# EAGLE design HGS_Reflector (EAGLE 9.4.0)
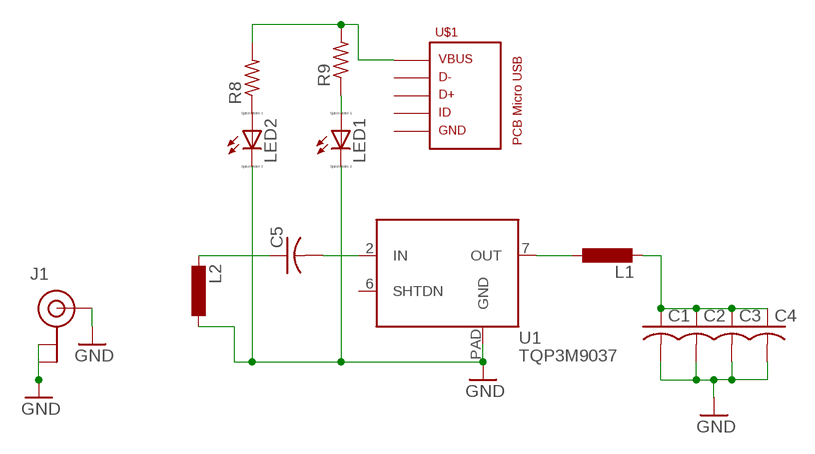
[diagram p0: schematic, sheet 1]

## Parts
C1  C-USC1210  [C1210]
C2  C-USC1210  [C1210]
C3  C-USC1210  [C1210]
C4  C-USC1210  [C1210]
C5  C-USC1210  [C1210]
J1  U.FL  [U.FL]
L1  L-EUL3216C  [L3216C]
L2  L-EUL3216C  [L3216C]
LED1  LED_E  [LED_1206]
LED2  LED_E  [LED_1206]
R8  R-US_R0402  [R0402]
R9  R-US_R0402  [R0402]
U1  TQP3M9037  [DFN8-2X2-WITH-PAD]
U$1  PCB_MICRO_USB_BSS_1  [USB_TYPE_B_SS_1]

## Nets
GND: C1.2 C2.2 C3.2 C4.2 J1.1(GND) J1.2(GND) J1.FEED(SIGNAL) L2.1 LED1.C LED2.C U1.PAD(GND)
N$5: L1.1 U1.7(OUT)
N$6: C1.1 C2.1 C3.1 C4.1 L1.2
N$7: C5.1 L2.2
N$8: C5.2 U1.2(IN)
N$9: LED2.A R8.1
N$10: LED1.A R9.1
N$11: R8.2 R9.2 U$1.1
Unconnected: U1.6(SHTDN) U$1.2 U$1.3 U$1.4 U$1.5

## Library data of the parts
C1-C5 = rcl:C-US: CAPACITOR, American symbol; SPICEPREFIX: C
J1 = SparkFun-Connectors:U.FL: SMD Antenna Connector - U.FL 2mm height, 3.0mm x 3.0mm receptacle size. SparkFun Products: SparkFun WiFi Shield - ESP8266 <https://www.sparkfun.com/products/13287> SparkFun ESP8266 Thing <https://www.sparkfun.com/products/13231> SparkFun MiniGen - Pro Mini Signal Generator Shield <https://www.sparkfun.com/products/11420>; PROD_ID: CONN-09193; SF_ID: WRL-09144
L1 L2 = rcl:L-EU: INDUCTOR, European symbol; SPICEPREFIX: L
LED1 LED2 = eagle-ltspice:LED_E: LED Source: http://www.osram.convergy.de Source: www.luxeon.com Source: www.kingbright.com; SPICEMODEL: NONE; SPICEPREFIX: D; SPICETYPE: diode
R8 R9 = rcl:R-US_: RESISTOR, American symbol; SPICEPREFIX: R
U1 = U-Qorvo-TQP3M9037-LNA:TQP3M9037: Ultra Low Noise, High Linearity LNA 0.7 - 6.0 GHz Operational Bandwidth Source: Datasheet <https://www.qorvo.com/products/p/TQP3M9037>
U$1 = USB_pcb_connectors:PCB_MICRO_USB_B

## Board
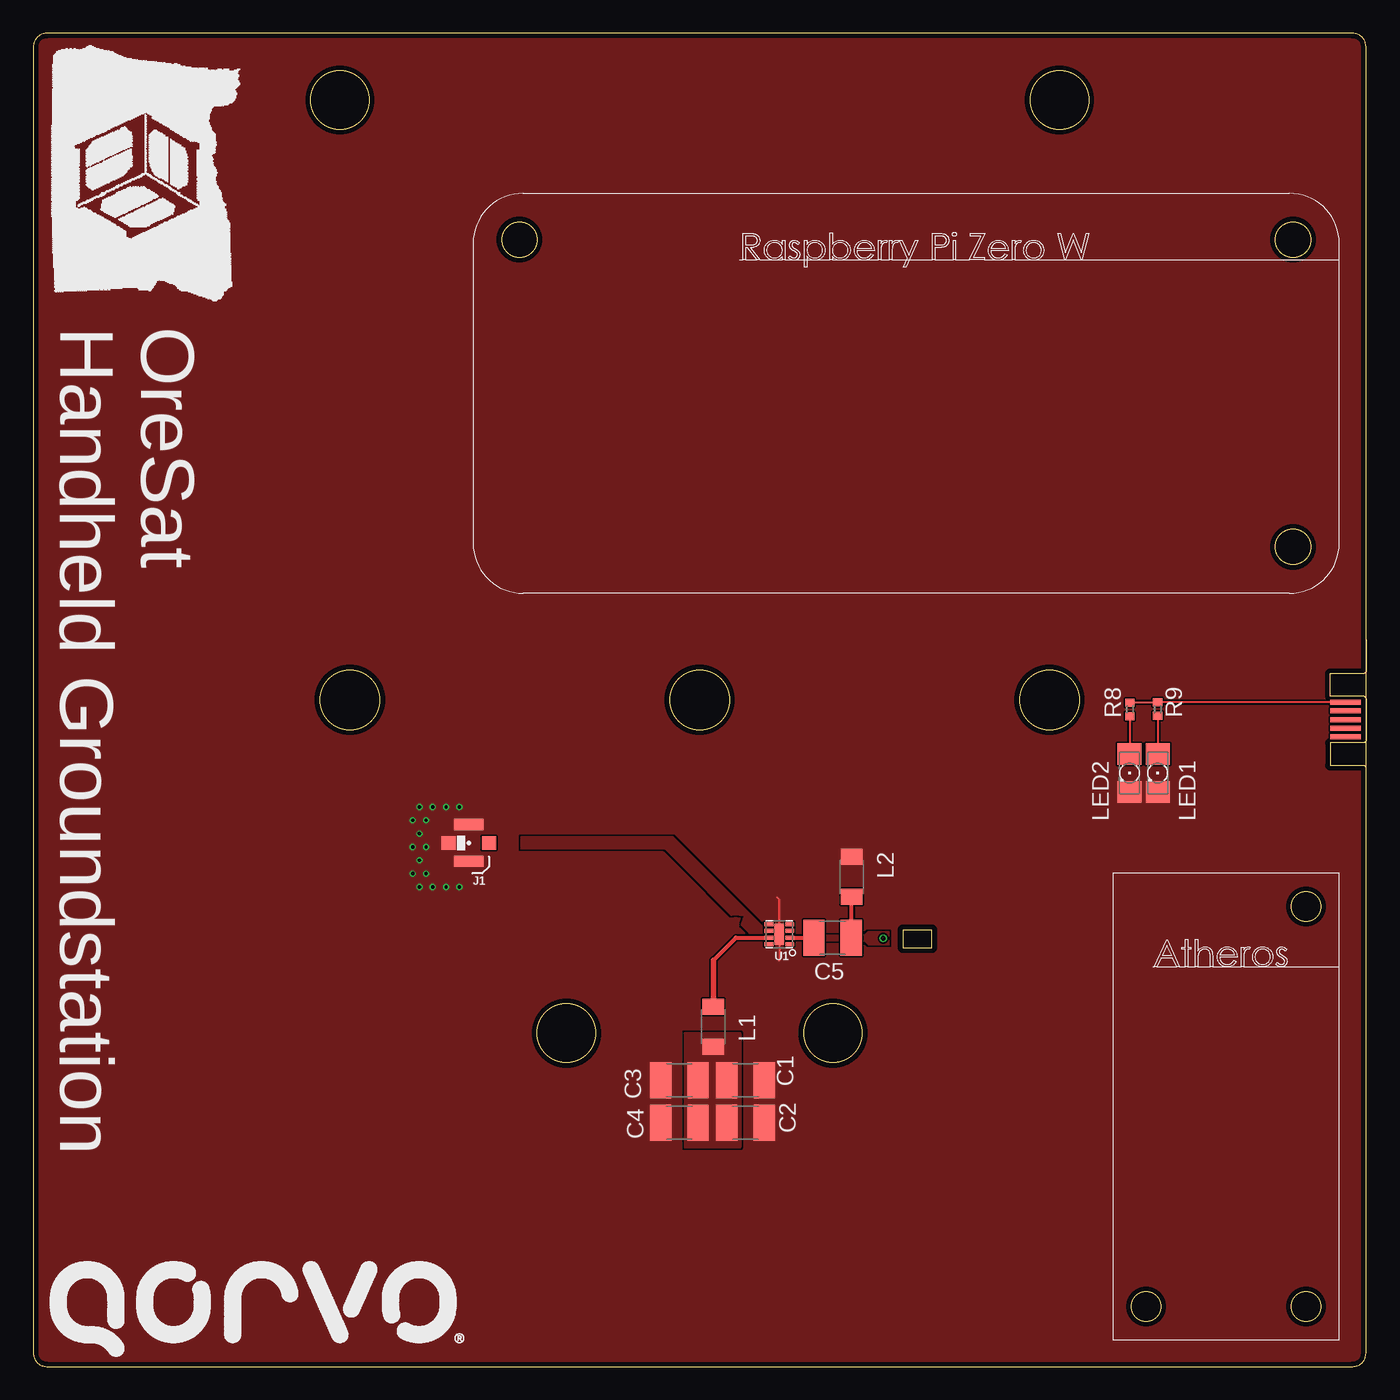
[diagram p1: board, top side]

Size 100.01 x 100 mm. Coordinates in mm from the lower left corner, seen from the top.
Outline: 100,1 100,99 arc90 99,100 1,100 arc90 0,99 0,1 arc90 1,0 99,0 arc90 100,1
Outline: 65.24,32.78 65.24,31.41 67.42,31.41 67.42,32.78 65.24,32.78
Outline: circle at 50,50 radius 2.25
Outline: circle at 40,25 radius 2.2
Outline: circle at 60,25 radius 2.2
Outline: circle at 94.53,61.48 radius 1.32
Outline: circle at 83.5,4.5 radius 1.1
Outline: circle at 76.25,50 radius 2.25
Outline: circle at 23.75,50 radius 2.25
Outline: circle at 94.53,84.53 radius 1.32
Outline: circle at 77,95 radius 2.2
Outline: circle at 23,95 radius 2.2
Outline: circle at 36.48,84.53 radius 1.32
Outline: circle at 95.5,34.5 radius 1.1
Outline: circle at 95.5,4.5 radius 1.1
Copper layers (1*2*15*16): Top 0.035559375mm / dielectric 0.17018125mm / Route2 0.01778125mm / dielectric 47mil / Route15 0.01778125mm / dielectric 0.17018125mm / Bottom 0.035559375mm
Design rules "oshpark-4layer-tented": minimum track width 5mil, minimum drill 10mil, track to track 5mil, track to pad 5mil, pad to pad 5mil, via to via 5mil, smd to smd 5mil, copper to edge 15mil, drill to drill 6mil, minimum pad ring 4mil, minimum via ring 4mil, stop-mask expansion 2.5mil, vias tented up to drill 20mil, thermal gap 10mil

### Footprints (pad centres in the part's own frame; a part is rotated, then mirrored left to right if it is on the bottom)
C1210 = smd 1.6 x 2.7: 1 -1.4,0; 2 1.4,0
U.FL = smd 2.2 x 0.85: 1 0,1.375; 2 0,-1.375 | smd 1.05 x 1: FEED 1.525,0; NC -1.525,0
L3216C = smd 1.2 x 1.6: 1 -1.5,0; 2 1.5,0
LED_1206 = smd 1.6 x 1.803: A -1.422,0; C 1.422,0
R0402 = smd 0.6 x 0.7: 1 -0.5,0; 2 0.5,0
DFN8-2X2-WITH-PAD = smd 0.3 x 0.67: 1 -0.75,-0.785; 2 -0.25,-0.785; 3 0.25,-0.785; 4 0.75,-0.785; 5 0.75,0.785; 6 0.25,0.785; 7 -0.25,0.785; 8 -0.75,0.785 | smd 1.6 x 0.7: PAD 0,0
USB_TYPE_B_SS_1 = smd 0.37 x 2.3: 1 -1.3,-1.55; 2 -0.65,-1.55; 3 0,-1.55; 4 0.65,-1.55; 5 1.3,-1.55

### Placement (x,y rotation side)
C1  53.44,21.47 0 top
C2  53.44,18.29 0 top
C3  48.47,21.47 180 top
C4  48.47,18.29 180 top
C5  59.97,32.16 180 top
J1  32.67,39.27 180 top
L1  51.02,25.5 270 top
L2  61.41,36.72 270 top
LED1  84.37,44.51 270 top
LED2  82.26,44.51 270 top
R8  82.28,49.29 90 top
R9  84.37,49.31 90 top
U1  55.97,32.42 90 top
U$1  100.01,48.53 270 top

### Tracks (layer width: path | path; a pad name or v marks a point on that pad's centre or on a via)
GND  (via drill 0.25)
  Top 0.152: 55.97,30.47 U1.PAD 55.97,35.02 55.82,35.17
  other vias: 29.47,40.97 28.47,40.97 28.97,39.97 28.47,38.97 29.47,38.97 28.97,37.97 28.47,36.97 29.47,36.97 28.97,35.97 29.97,35.97 30.97,35.97 31.97,35.97 28.97,41.97 29.97,41.97 30.97,41.97 31.97,41.97
  pour Top (no thermals): 31.82,41.42 31.82,38.37 33.37,38.37 33.37,36.87 30.12,36.87 30.12,41.42
  pour Top (no thermals): 31.72,41.42 33.42,41.42 33.42,40.12 31.72,40.12
  pour Top (rank 5, no thermals): 0.07,-0.13 101.57,-0.13 101.72,0.02 101.72,100.57 101.62,100.67 -0.48,100.67 -0.48,-0.08 -0.48,-0.13 0.02,-0.13
N$1
  pour Top (isolate 2, no thermals): 34.52,39.62 34.52,38.92 35.27,38.92 35.27,39.62
N$2  (via drill 0.35)
  other vias: 63.77,32.12
N$3
  pour Top (isolate 1.5, no thermals): 36.62,39.72 42.12,39.72 42.12,38.82 36.62,38.82
  pour Top (isolate 2, no thermals): 35.97,39.62 35.97,38.92 36.72,38.92 36.72,39.62
  pour Top (isolate 1.5): 41.92,39.72 47.97,39.72 54.77,32.92 55.47,32.92 55.47,32.47 53.77,32.47 47.42,38.82 41.92,38.82
  pour Top: 53.12,33.12 53.72,32.52 55.32,32.52 55.32,32.82 54.87,32.82 53.49,34.2
N$4
  pour Top: 64.22,32.57 62.62,32.57 62.37,32.32 56.42,32.32 56.42,31.97 62.37,31.97 62.67,31.67 64.22,31.67
N$5
  Top 0.3: 51.02,30.47 52.72,32.17 U1.7
  Top 0.4: L1.1 51.02,30.47
N$6
  pour Top (no thermals): 48.97,24.97 52.97,24.97 52.97,16.47 48.97,16.47
N$7
  Top 0.3: C5.1 61.37,35.18 L2.2
N$8
  Top 0.3: U1.2 C5.2
N$9
  Top 0.152: R8.1 82.28,45.96 LED2.A
N$10
  Top 0.152: R9.1 LED1.A
N$11
  Top 0.152: U$1.1 84.38,49.83 R9.2 82.31,49.81 R8.2

### Text on the board
tPlace: OreSat / Handheld Groundstation